# EAGLE design 降圧 (EAGLE 7.4.0)
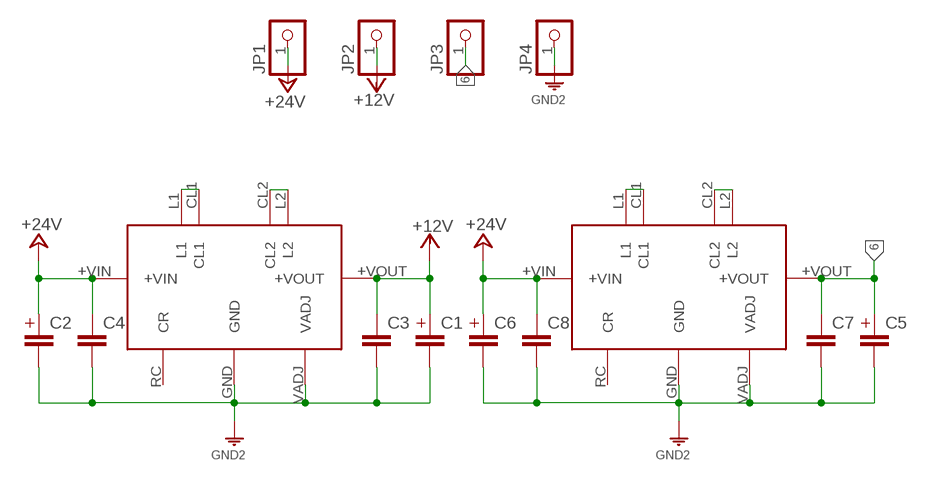
[diagram p0: schematic, sheet 1]

## Parts
C1  CAPACITOR-1U  [C_1U]
C2  CAPACITOR-1U  [C_1U]
C3  MLCC-5  [MLCC_50]
C4  MLCC-5  [MLCC_50]
C5  CAPACITOR-1U  [C_1U]
C6  CAPACITOR-1U  [C_1U]
C7  MLCC-5  [MLCC_50]
C8  MLCC-5  [MLCC_50]
JP1  PINHD-1X1  [1X01]
JP2  PINHD-1X1  [1X01]
JP3  PINHD-1X1  [1X01]
JP4  PINHD-1X1  [1X01]
U$1  HPH12002M  [HPH12002M]
U$4  HPH12002M  [HPH12002M]

## Nets
6: C5.P$1 C7.1 JP3.1 U$4.+VOUT
+12V: C1.P$1 C3.1 JP2.1 U$1.+VOUT
+24V: C2.P$1 C4.1 C6.P$1 C8.1 JP1.1 U$1.+VIN U$4.+VIN
GND: C1.P$2 C2.P$2 C3.2 C4.2 C5.P$2 C6.P$2 C7.2 C8.2 JP4.1 U$1.GND U$1.VADJ U$4.GND U$4.VADJ ; supply symbol labelled GND2
N$1: U$1.CL1 U$1.L1
N$2: U$1.CL2 U$1.L2
N$3: U$4.CL1 U$4.L1
N$4: U$4.CL2 U$4.L2
Unconnected: U$1.RC(CR) U$4.RC(CR)

## Library data of the parts
C1 C2 C5 C6 = rcl__s:CAPACITOR
C3 C4 C7 C8 = rcl__s:MLCC: CAPACITOR, European symbol
JP1-JP4 = pinhead_s:PINHD-1X1: PIN HEADER
U$1 U$4 = dc-dc_s:HPH12002M: ＤＣ－ＤＣコンバータ ５～２４Ｖ可変 http://akizukidenshi.com/catalog/g/gM-02038/

## Board
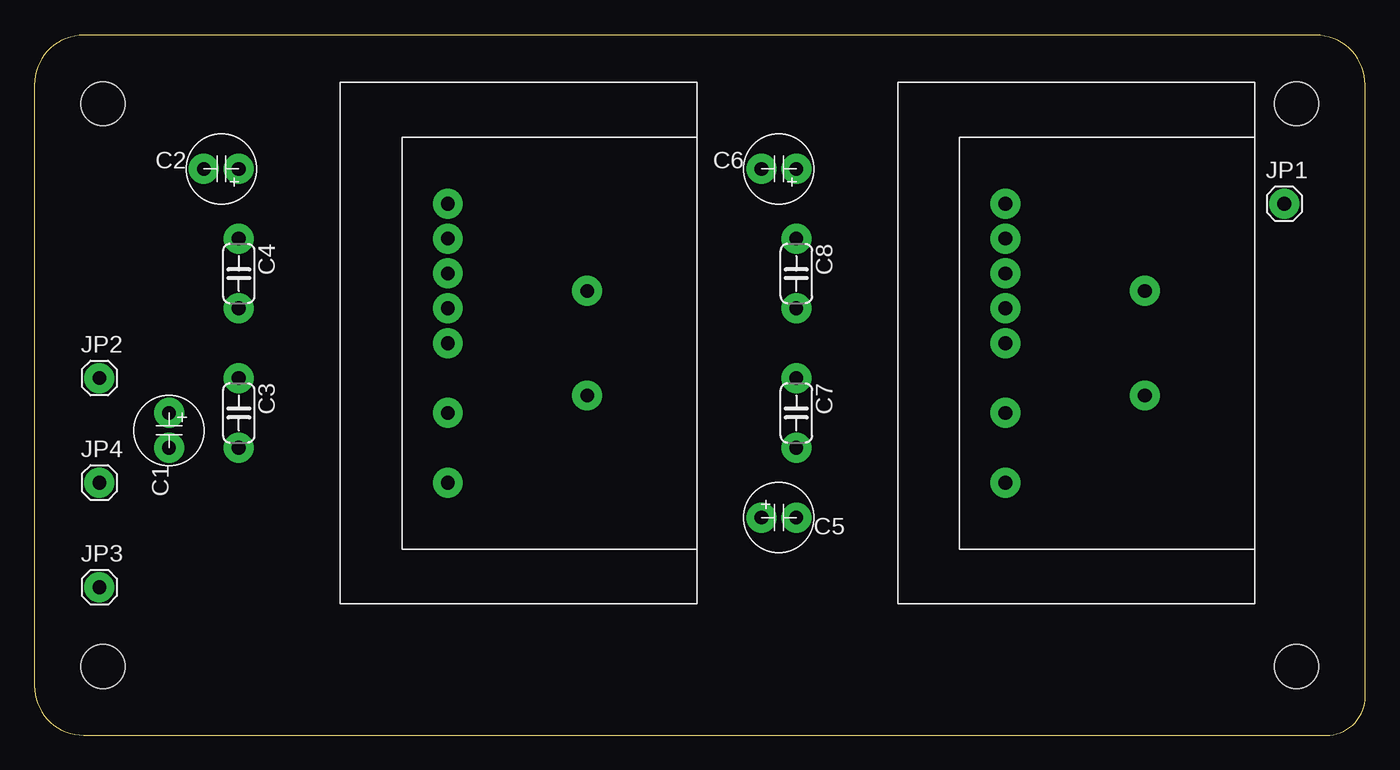
[diagram p1: board, top side]
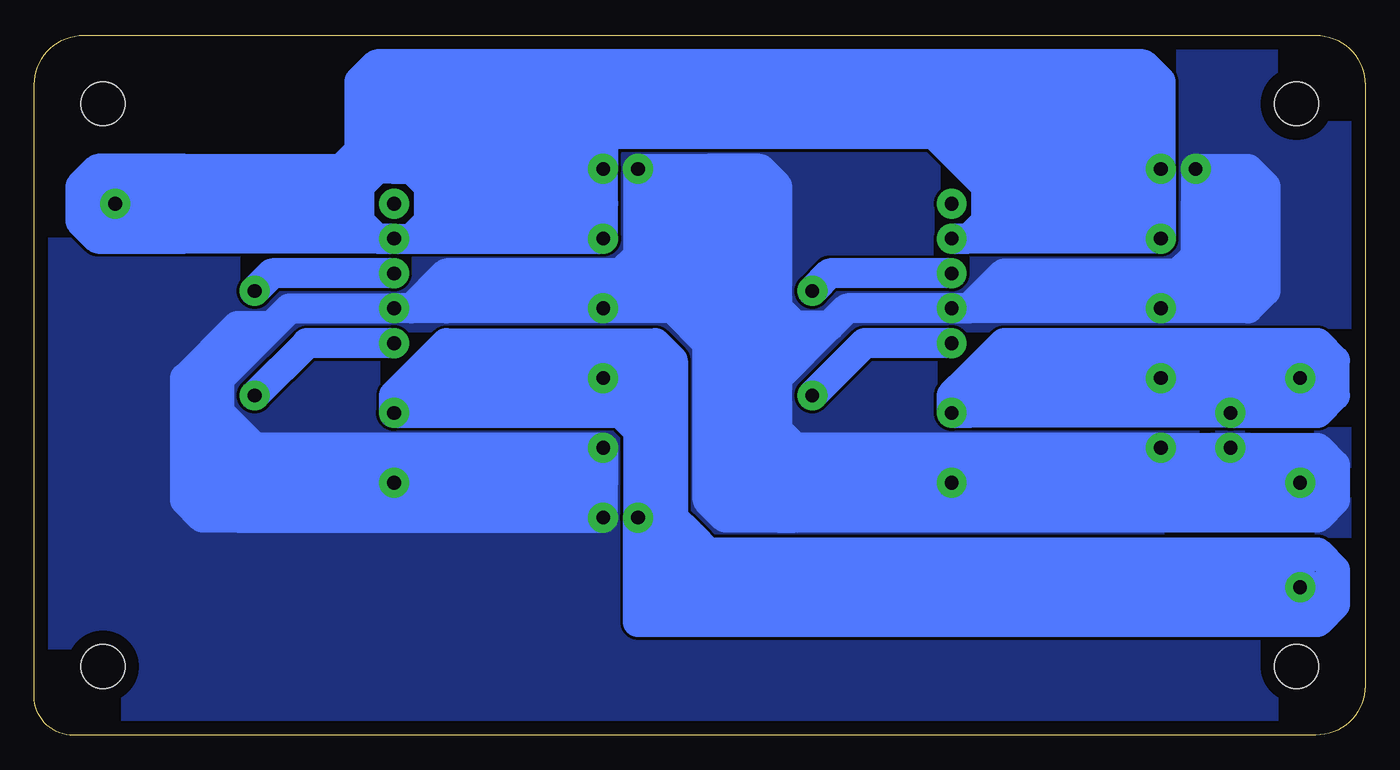
[diagram p2: board, bottom side, seen from below]

Size 97 x 51 mm. Coordinates in mm from the lower left corner, seen from the top.
Outline: 0,47.39 0,3.61 arc90 3.61,0 94.17,0 arc90 97,2.83 97,47.39 arc90 93.39,51 3.61,51 arc90 0,47.39
Copper layers (1*16): Top 0.035mm / dielectric 1.5mm / Bottom 0.035mm
Design rules "default": minimum track width 10mil, minimum drill 24mil, track to track 8mil, track to pad 8mil, pad to pad 8mil, via to via 8mil, smd to smd 8mil, copper to edge 40mil, drill to drill 8mil, minimum pad ring 10mil, minimum via ring 8mil, stop-mask expansion 4mil, vias tented up to drill 0mil, thermal gap 10mil
Holes 3.2 mm at 5,46 5,5 92,5 92,46

### Footprints (pad centres in the part's own frame; a part is rotated, then mirrored left to right if it is on the bottom)
C_1U = drill 1 pad 2.184: P$1 -1.27,0; P$2 1.27,0
MLCC_50 = drill 1 pad 2.184: 1 -2.54,0; 2 2.54,0
1X01 = drill 1 pad 2.184: 1 0,0
HPH12002M = drill 1 pad 2.184: +VIN -7.62,-10.16; +VOUT 5.08,-10.16; CL1 0,-10.16; CL2 -5.08,-10.16; GND -2.54,-10.16; L1 3.81,0; L2 -3.81,0; RC -10.16,-10.16; VADJ 10.16,-10.16

### Placement (x,y rotation side)
C1  9.82,22.21 270 top
C2  13.63,41.26 180 top
C3  14.9,23.48 270 top
C4  14.9,33.64 270 top
C5  54.27,15.86 0 top
C6  54.27,41.26 180 top
C7  55.54,23.48 270 top
C8  55.54,33.64 270 top
JP1  91.1,38.72 0 top
JP2  4.74,26.02 0 top
JP3  4.74,10.78 0 top
JP4  4.74,18.4 0 top
U$1  40.3,28.56 270 top
U$4  80.94,28.56 270 top

### Tracks (layer width: path | path; a pad name or v marks a point on that pad's centre or on a via)
6
  Bottom 2.184: 53,22.21 53,23.48 C7.1 68.24,26.02 U$4.+VOUT | 53,22.21 C5.P$1 53,13.32 | JP3.1 53,10.78 | 53,10.78 53,13.32 | 53,13.32 51.73,13.32 | 51.73,13.32 49.19,13.32 | 49.19,13.32 47.92,13.32 | 47.92,13.32 3.47,13.32 2.2,12.05 2.2,9.51 3.47,8.24 53,8.24 53,10.78 | 53,10.78 51.73,9.51 4.74,9.51 3.47,10.78 JP3.1 | JP3.1 6.01,12.05 | 6.01,12.05 4.74,12.05 | 6.01,12.05 51.73,12.05 | U$4.+VOUT 54.27,23.48 | 54.27,23.48 53,22.21 | 54.27,23.48 55.54,24.75 68.24,24.75 | U$4.+VOUT 70.78,24.75 66.97,28.56 51.73,28.56 50.46,27.29 50.46,15.86 | 50.46,15.86 50.46,14.59 49.19,13.32 | 49.19,13.32 49.19,14.59 | 49.19,14.59 50.46,15.86 | 49.19,14.59 47.92,13.32 | 51.73,13.32 51.73,26.02 53,27.29 55.54,27.29 | 66.97,27.29 55.54,27.29 | 55.54,27.29 53,24.75
+12V
  Bottom 2.184: JP2.1 9.82,26.02 | 9.82,26.02 C3.1 26.33,26.02 | C1.P$1 9.82,26.02 | 26.33,26.02 27.6,26.02 | 27.6,26.02 28.87,26.02 | C1.P$1 3.47,23.48 2.2,24.75 2.2,27.29 3.47,28.56 26.33,28.56 28.87,26.02 | C1.P$1 8.55,24.75 4.74,24.75 3.47,26.02 4.74,27.29 25.06,27.29 26.33,26.02 | C1.P$1 U$1.+VOUT | 11.09,24.75 9.82,26.02 | 27.6,26.02 U$1.+VOUT | 28.87,26.02 30.14,24.75 U$1.+VOUT | U$1.+VOUT 28.87,23.48 27.6,24.75 12.36,24.75
+24V
  Bottom 2.184: U$4.+VIN C8.1 55.54,38.72 | 55.54,38.72 C6.P$1 55.54,42.53 | C2.P$1 14.9,37.45 | 14.9,37.45 C4.1 U$1.+VIN 28.87,36.18 27.6,37.45 27.6,39.99 28.87,41.26 | 28.87,41.26 31.41,43.8 55.54,43.8 | 55.54,43.8 55.54,42.53 | C2.P$1 27.6,41.26 | 28.87,41.26 27.6,41.26 | 27.6,41.26 26.33,39.99 16.17,39.99 16.17,38.72 26.33,38.72 26.33,37.45 14.9,37.45 | C2.P$1 14.9,47.61 16.17,48.88 55.54,48.88 | 55.54,48.88 55.54,43.8 | 55.54,43.8 54.27,45.07 16.17,45.07 16.17,43.8 30.14,43.8 28.87,42.53 16.17,42.53 16.17,46.34 54.27,46.34 54.27,47.61 16.17,47.61 | U$4.+VIN 69.51,36.18 68.24,37.45 68.24,39.99 69.51,41.26 | 69.51,41.26 68.24,41.26 | 68.24,41.26 56.81,41.26 56.81,39.99 66.97,39.99 66.97,38.72 55.54,38.72 | 55.54,38.72 56.81,37.45 66.97,37.45 | 55.54,48.88 70.78,48.88 | 70.78,48.88 70.78,42.53 | 70.78,42.53 70.78,41.26 | 70.78,41.26 69.51,41.26 | 68.24,41.26 69.51,42.53 55.54,42.53 | 55.54,42.53 56.81,43.8 69.51,43.8 69.51,45.07 56.81,45.07 56.81,46.34 69.51,46.34 69.51,47.61 56.81,47.61 | 70.78,41.26 72.05,41.26 | 72.05,41.26 73.32,39.99 73.32,38.72 | 73.32,38.72 73.32,37.45 72.05,36.18 U$4.+VIN | U$4.+VIN 86.02,36.18 | 86.02,36.18 86.02,41.26 | 86.02,41.26 74.59,41.26 | 74.59,41.26 73.32,41.26 | 73.32,41.26 72.05,41.26 | 72.05,41.26 70.78,42.53 | 73.32,38.72 74.59,39.99 84.75,39.99 84.75,38.72 75.86,38.72 74.59,37.45 84.75,37.45 | 86.02,41.26 92.37,41.26 93.64,39.99 93.64,37.45 92.37,36.18 86.02,36.18 | 86.02,36.18 87.29,37.45 91.1,37.45 92.37,38.72 | 92.37,38.72 91.1,39.99 87.29,39.99 87.29,38.72 JP1.1 92.37,38.72 | 70.78,48.88 72.05,47.61 72.05,42.53 73.32,41.26 | 70.78,48.88 72.05,48.88 73.32,47.61 73.32,42.53 74.59,41.26
GND
  Bottom 2.184: 42.84,15.86 46.65,15.86 47.92,17.13 47.92,28.56 | U$1.GND 37.76,31.1 39.03,29.83 | 39.03,29.83 41.57,29.83 | 41.57,29.83 42.84,31.1 | 42.84,31.1 44.11,31.1 | 44.11,31.1 46.65,31.1 | 46.65,31.1 47.92,31.1 | 49.19,31.1 50.46,31.1 | 50.46,31.1 C8.2 | C8.2 66.97,31.1 | 66.97,31.1 69.51,31.1 | 69.51,31.1 U$4.GND 78.4,31.1 79.67,29.83 | 53,34.91 C6.P$2 49.19,41.26 | 53,34.91 53,33.64 | 53,33.64 C8.2 | 14.9,18.4 14.9,17.13 | 14.9,17.13 C1.P$2 | C5.P$2 55.54,18.4 | C3.2 14.9,18.4 | 14.9,18.4 16.17,18.4 | 16.17,18.4 U$1.VADJ 40.3,18.4 42.84,20.94 | 42.84,20.94 42.84,22.21 | 42.84,22.21 42.84,26.02 | 42.84,26.02 42.84,28.56 | 42.84,28.56 41.57,29.83 | 55.54,18.4 C7.2 80.94,20.94 83.48,23.48 | 55.54,18.4 U$4.VADJ 80.94,18.4 83.48,20.94 | 83.48,20.94 83.48,23.48 | 83.48,23.48 83.48,26.02 79.67,29.83 | 42.84,28.56 42.84,29.83 | 42.84,29.83 42.84,31.1 | 44.11,31.1 42.84,29.83 | 39.03,29.83 42.84,26.02 | C3.2 14.9,19.67 16.17,18.4 | 14.9,17.13 16.17,18.4 | 53,33.64 54.27,33.64 | 54.27,33.64 66.97,33.64 69.51,31.1 | 66.97,31.1 65.7,32.37 55.54,32.37 | C3.2 41.57,20.94 42.84,22.21 | 42.84,20.94 42.84,17.13 41.57,15.86 | 41.57,15.86 C1.P$2 | C1.P$2 16.17,15.86 17.44,17.13 40.3,17.13 41.57,18.4 40.3,19.67 16.17,19.67 | 47.92,28.56 47.92,29.83 49.19,31.1 | 49.19,31.1 47.92,31.1 | 47.92,31.1 46.65,29.83 46.65,18.4 45.38,17.13 44.11,17.13 44.11,28.56 45.38,29.83 45.38,18.4 42.84,15.86 | 42.84,15.86 41.57,15.86 | 83.48,20.94 83.48,17.13 82.21,15.86 | 82.21,15.86 C5.P$2 | C5.P$2 56.81,17.13 82.21,17.13 82.21,18.4 80.94,19.67 56.81,19.67 | 50.46,31.1 47.92,28.56 | 49.19,41.26 47.92,39.99 47.92,32.37 | 47.92,32.37 47.92,31.1 | 47.92,31.1 49.19,32.37 49.19,38.72 50.46,39.99 50.46,32.37 51.73,32.37
  Bottom 2.184: 53,32.37 51.73,32.37 | 51.73,32.37 51.73,39.99 | 47.92,32.37 46.65,31.1 | 53,34.91 54.27,33.64 | 42.84,31.1 42.84,32.37 | 42.84,37.45 42.84,39.99 44.11,41.26 47.92,41.26 | 49.19,41.26 47.92,41.26 | 47.92,41.26 46.65,39.99 46.65,33.64 45.38,32.37 42.84,32.37 | 42.84,32.37 42.84,37.45 | 42.84,37.45 45.38,39.99 45.38,34.91 44.11,33.64 44.11,37.45 | 82.21,15.86 83.48,15.86 | 83.48,15.86 84.75,15.86 86.02,17.13 86.02,18.4 | 86.02,18.4 86.02,26.02 | 86.02,26.02 82.21,29.83 79.67,29.83 | 86.02,26.02 84.75,26.02 84.75,18.4 | 86.02,18.4 83.48,15.86 | JP4.1 14.9,18.4 | 12.36,38.72 C2.P$2 8.55,41.26 7.28,39.99 7.28,32.37 8.55,31.1 C4.2 | 12.36,34.91 12.36,33.64 C4.2 | C3.2 3.47,20.94 2.2,19.67 2.2,17.13 3.47,15.86 41.57,15.86 | C4.2 U$1.GND | U$1.GND 28.87,31.1 26.33,33.64 13.63,33.64 12.36,34.91 | 12.36,34.91 12.36,38.72 | 12.36,38.72 11.09,39.99 11.09,33.64 12.36,32.37 | 12.36,32.37 26.33,32.37 | 12.36,32.37 9.82,32.37 8.55,33.64 8.55,38.72 9.82,39.99 9.82,33.64
  pour Bottom: -0.34,51.42 96.18,51.42 96.18,0.62 -0.34,0.62
N$1
  Bottom 2.184: U$1.CL1 36.49,28.56 U$1.L1
N$2
  Bottom 2.184: U$1.CL2 39.03,33.64 U$1.L2
N$3
  Bottom 2.184: U$4.CL1 77.13,28.56 U$4.L1
N$4
  Bottom 2.184: U$4.CL2 79.67,33.64 U$4.L2
N$6
  Bottom 2.184: 11.09,19.67 4.74,19.67 3.47,18.4 4.74,17.13 13.63,17.13